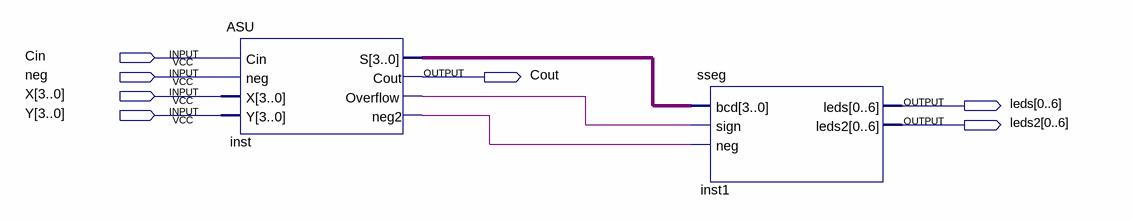
[diagram p0: schematic sheet]
// Quartus schematic CombinedASU1.bdf as structural Verilog: 2 symbols, 7 pins
module CombinedASU1 (
  input  Cin,
  input  neg,
  input  [3:0] X,
  input  [3:0] Y,
  output Cout,
  output [0:6] leds,
  output [0:6] leds2
);

  wire inst_neg2, inst_overflow;
  wire [3:0] inst_s;

  ASU inst (.Cin(Cin), .neg(neg), .X(X), .Y(Y), .S(inst_s), .Cout(Cout), .Overflow(inst_overflow), .neg2(inst_neg2));
  sseg inst1 (.bcd(inst_s), .sign(inst_overflow), .neg(inst_neg2), .leds(leds), .leds2(leds2));
endmodule
